# Altium schematic sheet micro.SchDoc
size A3
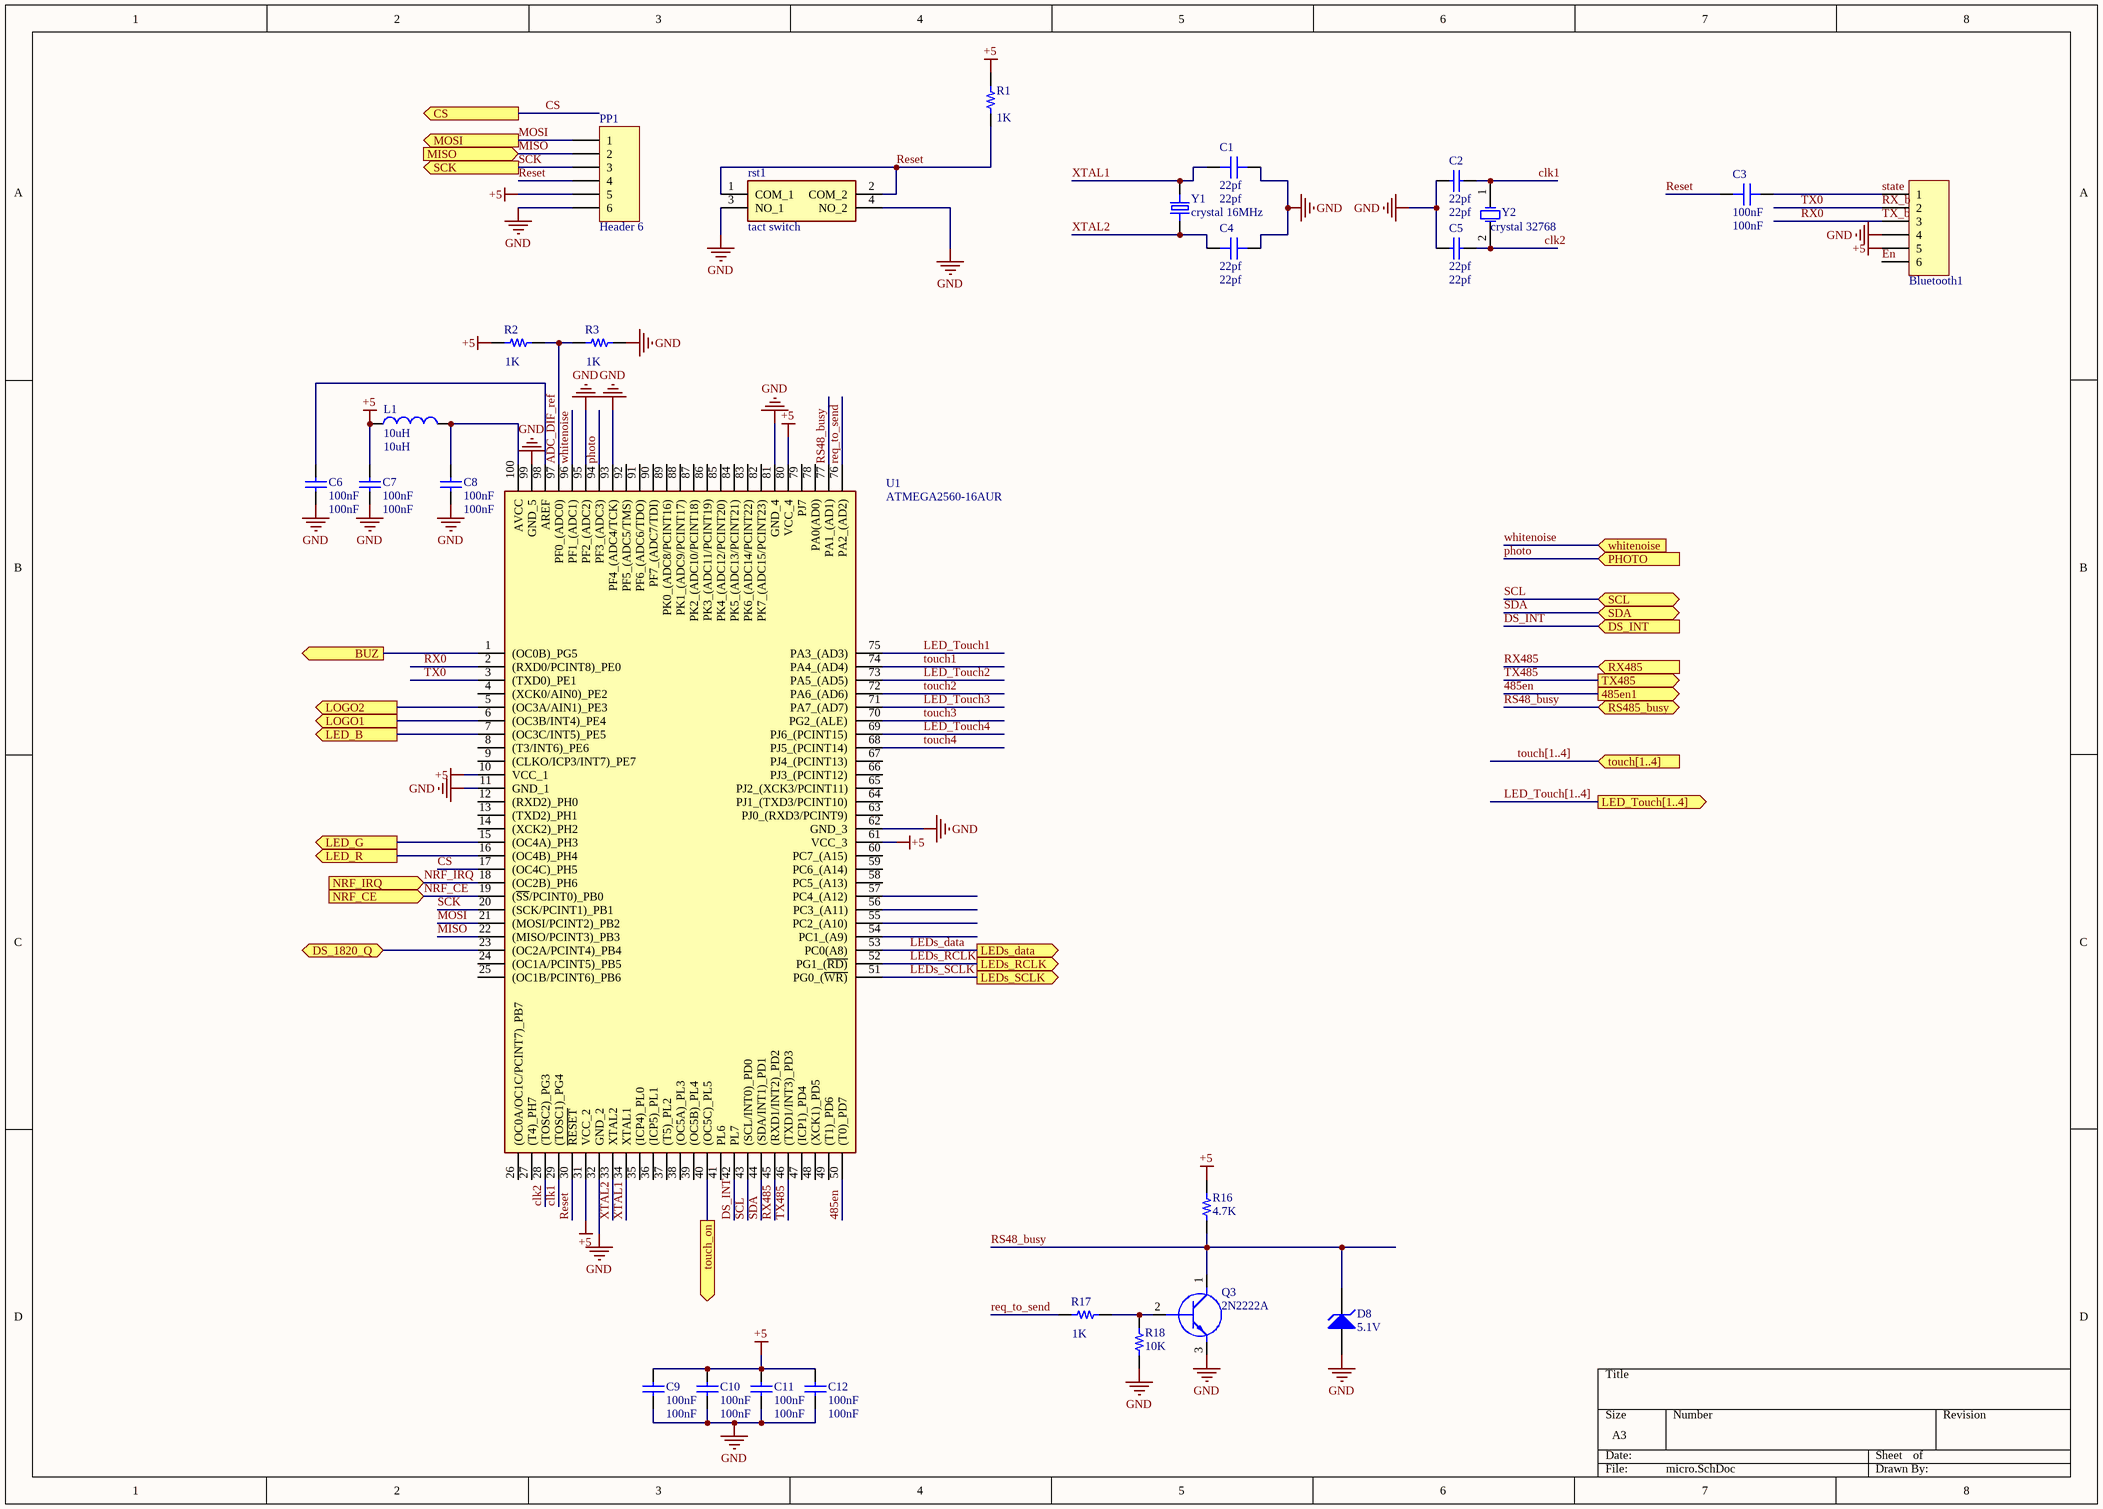
[diagram p0: micro.SchDoc]

## Parts
Bluetooth1  Header 6  [H-1x6]  (value not drawn)
C1  22pf  [0603C]
C2  22pf  [0603C]
C3  100nF  [0603C]
C4  22pf  [0603C]
C5  22pf  [0603C]
C6  100nF  [0603C]
C7  100nF  [0603C]
C8  100nF  [0603C]
C9  100nF  [0603C]
C10  100nF  [0603C]
C11  100nF  [0603C]
C12  100nF  [0603C]
D8  5.1V  [Diode 1n4148 SMD]
L1  10uH  [IND1206]
PP1  Header 6  [HDR1X6]
Q3  2N2222A  [soT95p280x130-3n]
R1  1K  [0603R]
R2  1K  [0603R]
R3  1K  [0603R]
R16  4.7K  [0603R]
R17  1K  [0603R]
R18  10K  [0603R]
rst1  tact switch  [DTSM63NVB]
U1  ATMEGA2560-16AUR  [QFP50P1600X1600X120-100N]
Y1  crystal 16MHz  [XTAL_ECS-180-S-5P-DN-TR]
Y2  crystal 32768  [XTAL RTC]

## Ports
485en1 (out), BUZ (out), CS (out), DS_1820_Q (bidir), DS_INT (in), LED_B (out), LED_G (out), LED_R (out), LED_Touch[1..4] (out), LEDs_data (out), LEDs_RCLK (out), LEDs_SCLK (out), LOGO1 (out), LOGO2 (out), MISO (in), MOSI (out), NRF_CE (in), NRF_IRQ (in), PHOTO (in), RS485_busy (bidir), RX485 (in), SCK (out), SCL (bidir), SDA (bidir), touch[1..4] (in), touch_on (out), TX485 (out), whitenoise (in)

## Nets
+5: Bluetooth1.5 C7.1 C9.1 C10.1 C11.1 C12.1 L1.1 PP1.5 R1.2 R2.2 R16.1 U1.10(VCC_1) U1.31(VCC_2) U1.61(VCC_3) U1.80(VCC_4)
GND: Bluetooth1.4 C1.1 C2.1 C4.1 C5.2 C6.2 C7.2 C8.2 C9.2 C10.2 C11.2 C12.2 D8.1(A) PP1.6 Q3.3(E) R3.1 R18.2 rst1.3(NO_1) rst1.4(NO_2) U1.11(GND_1) U1.32(GND_2) U1.62(GND_3) U1.81(GND_4) U1.93(PF4_(ADC4/TCK)) U1.95(PF2_(ADC2)) U1.99(GND_5)
485en: U1.50((T0)_PD7) ; port 485en1
ADC_DIF_ref: R2.1 R3.2 U1.97(PF0_(ADC0))
BUZ: U1.1((OC0B)_PG5) ; port BUZ
clk1: C2.2 U1.29((TOSC1)_PG4) Y2.1(OSC1)
clk2: C5.1 U1.28((TOSC2)_PG3) Y2.2(OSC2)
CS: U1.17((OC4C)_PH5) ; port CS
DS_1820_Q: U1.23((OC2A/PCINT4)_PB4) ; port DS_1820_Q
DS_INT: U1.42(PL7) ; port DS_INT
En: Bluetooth1.6
LED_B: U1.7((OC3C/INT5)_PE5) ; port LED_B
LED_G: U1.15((OC4A)_PH3) ; port LED_G
LED_R: U1.16((OC4B)_PH4) ; port LED_R
LED_Touch1: U1.75(PA3_(AD3))
LED_Touch2: U1.73(PA5_(AD5))
LED_Touch3: U1.71(PA7_(AD7))
LED_Touch4: U1.69(PJ6_(PCINT15))
LEDs_data: U1.53(PC0(A8)) ; port LEDs_data
LEDs_RCLK: U1.52(PG1_(~{RD)}) ; port LEDs_RCLK
LEDs_SCLK: U1.51(PG0_(~{WR)}) ; port LEDs_SCLK
LOGO1: U1.6((OC3B/INT4)_PE4) ; port LOGO1
LOGO2: U1.5((OC3A/AIN1)_PE3) ; port LOGO2
MISO: PP1.2 U1.22((MISO/PCINT3)_PB3) ; port MISO
MOSI: PP1.1 U1.21((MOSI/PCINT2)_PB2) ; port MOSI
NRF_CE: U1.19((~{SS}/PCINT0)_PB0) ; port NRF_CE
NRF_IRQ: U1.18((OC2B)_PH6) ; port NRF_IRQ
photo: U1.94(PF3_(ADC3)) ; port PHOTO
req_to_send: R17.2 U1.76(PA2_(AD2))
Reset: C3.2 PP1.4 R1.1 rst1.1(COM_1) rst1.2(COM_2) U1.30(~{RESET})
RS48_busy: D8.2(K) Q3.1(C) R16.2 U1.77(PA1_(AD1)) ; port RS485_busy
RX0: Bluetooth1.3 U1.2((RXD0/PCINT8)_PE0)  [also labelled TX_b]
RX485: U1.45((RXD1/INT2)_PD2) ; port RX485
RX_b: Bluetooth1.2 U1.3((TXD0)_PE1)  [also labelled TX0]
SCK: PP1.3 U1.20((SCK/PCINT1)_PB1) ; port SCK
SCL: U1.43((SCL/INT0)_PD0) ; port SCL
SDA: U1.44((SDA/INT1)_PD1) ; port SDA
state: Bluetooth1.1 C3.1
touch1: U1.74(PA4_(AD4))
touch2: U1.72(PA6_(AD6))
touch3: U1.70(PG2_(ALE))
touch4: U1.68(PJ5_(PCINT14))
touch_on: U1.40((OC5C)_PL5) ; port touch_on
TX485: U1.46((TXD1/INT3)_PD3) ; port TX485
whitenoise: U1.96(PF1_(ADC1)) ; port whitenoise
XTAL1: C1.2 U1.34(XTAL1) Y1.2
XTAL2: C4.2 U1.33(XTAL2) Y1.1
NetC6_1: C6.1 U1.98(AREF)
NetC8_1: C8.1 L1.2 U1.100(AVCC)
NetQ3_2: Q3.2(B) R17.1 R18.1

Not connected (* = marked no-connect by the designer): U1 4((XCK0/AIN0)_PE2) 8((T3/INT6)_PE6) 9((CLKO/ICP3/INT7)_PE7) 12((RXD2)_PH0) 13((TXD2)_PH1) 14((XCK2)_PH2) 24((OC1A/PCINT5)_PB5) 25((OC1B/PCINT6)_PB6) 26((OC0A/OC1C/PCINT7)_PB7) 27((T4)_PH7) 35((ICP4)_PL0) 36((ICP5)_PL1) 37((T5)_PL2) 38((OC5A)_PL3) 39((OC5B)_PL4) 41(PL6) 47((ICP1)_PD4) 48((XCK1)_PD5) 49((T1)_PD6) 54(PC1_(A9)) 55(PC2_(A10)) 56(PC3_(A11)) 57(PC4_(A12)) 58(PC5_(A13)) 59(PC6_(A14)) 60(PC7_(A15)) 63(PJ0_(RXD3/PCINT9)) 64(PJ1_(TXD3/PCINT10)) 65(PJ2_(XCK3/PCINT11)) 66(PJ3_(PCINT12)) 67(PJ4_(PCINT13)) 78(PA0(AD0)) 79(PJ7) 82(PK7_(ADC15/PCINT23)) 83(PK6_(ADC14/PCINT22)) 84(PK5_(ADC13/PCINT21)) 85(PK4_(ADC12/PCINT20)) 86(PK3_(ADC11/PCINT19)) 87(PK2_(ADC10/PCINT18)) 88(PK1_(ADC9/PCINT17)) 89(PK0_(ADC8/PCINT16)) 90(PF7_(ADC7/TDI)) 91(PF6_(ADC6/TDO)) 92(PF5_(ADC5/TMS))

## Buses and harness runs
bus LED_Touch[1..4] = port LED_Touch[1..4]
bus touch[1..4] = port touch[1..4]

## Library data of the parts
Bluetooth1 = H-1x6: Header, 6-Pin , female; pin to pad: 2>2.5
C1 C3 C4 = Capacitor: CAP SMD 0603; Part Number: C0805X106K9RAC7800
  C1 C4: Value: 22pf
  C3: Value: 100nF
C2 C5-C12 = Cap: CAP SMD 0603; Published: 8-Jun-2000; LatestRevisionDate: 17-Jul-2002; LatestRevisionNote: Re-released for DXP Platform.; PackageReference: RAD-0.3; Publisher: Altium Limited; PackageDescription: Radial Cap, Thru-Hole; 2 Leads; 0.3 in Pin Spacing
  C2 C5: Value: 22pf
  C6-C12: Value: 100nF
D8 = D Zener: Zener Diode 5.1v; Published: 8-Jun-2000; LatestRevisionDate: 17-Jul-2002; LatestRevisionNote: Re-released for DXP Platform.; PackageReference: DIODE-0.7; Publisher: Altium Limited; PackageDescription: Diode, Thru-Hole; 2 Leads; 0.7 in Pin Spacing
L1 = Inductor: Inductor 1206; Code_IEC: 1005; Published: 8-Jun-2000; LatestRevisionDate: 29-May-2009; LatestRevisionNote: IPC-7351 Footprint Added.; PackageReference: 0402-A; Publisher: Altium Limited; PackageDescription: Chip Inductor; Code_JEITA: 0402; Value: 10uH
PP1 = Header 6: Header, 6-Pin , female; LatestRevisionDate: 17-Jul-2002; LatestRevisionNote: Re-released for DXP Platform.; Publisher: Altium Limited
Q3 = 2N2222A: Transistor BJT NPN SMD; pin to pad: 1>3 2>1 3>2; Manufacturer_Name: Foshan Blue Rocket Elec; Datasheet Link: https://datasheet.lcsc.com/szlcsc/1901291437_Foshan-Blue-Rocket-Elec-2N2222A_C358533.pdf; Height: 4.7mm; Manufacturer_Part_Number: 2N2222A
R1-R3 R16-R18 = Resistor: RES SMD 0603; Part Number: RCS0805100KFKEA
  R1-R3 R17: Value: 1K
  R16: Value: 4.7K
  R18: Value: 10K
rst1 = DTSM-66R-V-T_R: Push Button SMD - 4PIN; Manufacturer_Name: Diptronics; Manufacturer_Part_Number: DTSM-66R-V-T/R; Datasheet Link: https://www.mouser.co.uk/datasheet/2/910/464_DTSMJ-6-1571536.pdf; Height: 7.1mm; Mouser Part Number: 113-DTSM66RVTR; Mouser Price/Stock: https://www.mouser.co.uk/ProductDetail/Diptronics/DTSM-66R-V-T-R?qs=MLItCLRbWsxl2%252BVY862AIw%3D%3D
U1 = ATMEGA2560-16AUR: ATMEGA2560-LQFP100; Manufacturer_Name: Microchip; Datasheet Link: http://ww1.microchip.com/downloads/en/DeviceDoc/Atmel-2549-8-bit-AVR-Microcontroller-ATmega640-1280-1281-2560-2561_datasheet.pdf; Height: 1.2mm; Manufacturer_Part_Number: ATMEGA2560-16AUR; Mouser Part Number: 556-ATMEGA2560-16AUR; Mouser Price/Stock: https://www.mouser.co.uk/ProductDetail/Microchip-Technology-Atmel/ATMEGA2560-16AUR?qs=6Dg1WZIWLC5tcX5fO8xzXQ%3D%3D; Arrow Part Number: ATMEGA2560-16AUR; Arrow Price/Stock: https://www.arrow.com/en/products/atmega2560-16aur/microchip-technology?region=nac
Y1 = ECS-180-S-5P-DN-TR: Crystals 16MHz; MF: ECS International; MP: ECS-180-S-5P-DN-TR; Value: 16MHz; SnapEDA_Link: https://www.snapeda.com/parts/ECS-180-S-5P-DN-TR/ECS%20International/view-part/2547669/?ref=snap; Price: None; Package: HC49/US ECS International; Availability: Unavailable
Y2 = XTAL: RTC crystal; Company: E.P.I.L; Value: 32768; Design Date: 11/04/2011